# Altium schematic sheet MicroMultimeter__PROBE_Sch.SchDoc: MicroMultimeter - Probe
size 152 x 101 mm; Author: Hom; CompanyName: KitSprout; DrawnBy: Hom; Engineer: Hom; Organization: KitSprout; Revision: A; SheetNumber: 1; SheetTotal: 1; License: CC BY-SA 4.0; Version: 1.0; LibVersion: 1.4; PageSetup: Record=PageOptions|CenterHorizontal=True|CenterVertical=True|PrintScale=1.00|XCorrection=1.00|YCorrection=1.00|PrintKind=0|BorderSize=5000000|LeftOffset=0|BottomOffset=0|Orientation=2|PaperLength=1000|PaperWidth=1000|Scale=100|PaperSource=7|PrintQuality=-3|MediaType=1|DitherType=10|PrintScaleMode=0|PaperKind=A4|PaperIndex=9
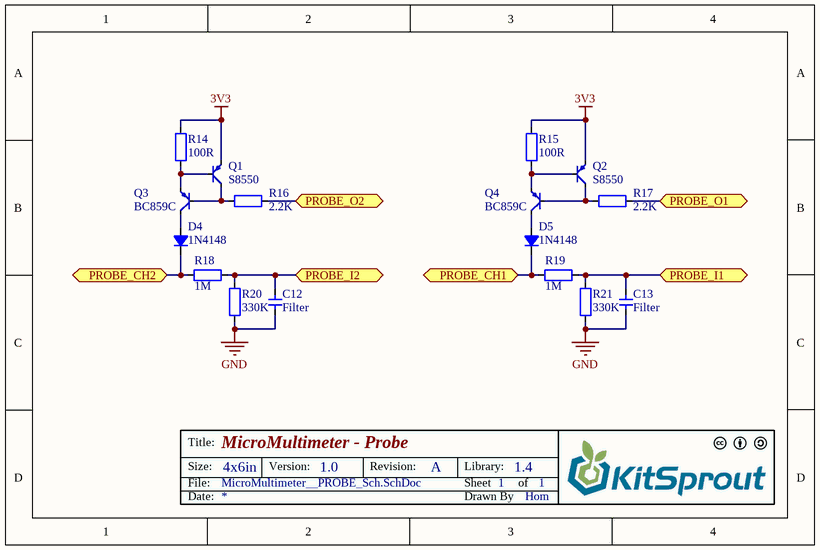
[diagram p0: MicroMultimeter__PROBE_Sch.SchDoc]

## Parts
C12  value Filter  [CAP_0603]  (hidden comment: Cap_0603)
C13  value Filter  [CAP_0603]  (hidden comment: Cap_0603)
D4  value 1N4148  [SOD323]  (hidden comment: Diode_SOD323)
D5  value 1N4148  [SOD323]  (hidden comment: Diode_SOD323)
Q1  value S8550  [SOT23-3]  (hidden comment: BJT_PNP)
Q2  value S8550  [SOT23-3]  (hidden comment: BJT_PNP)
Q3  value BC859C  [SOT23-3]  (hidden comment: BJT_PNP)
Q4  value BC859C  [SOT23-3]  (hidden comment: BJT_PNP)
R14  value 100R  [RES_0603]  (hidden comment: Res_0603)
R15  value 100R  [RES_0603]  (hidden comment: Res_0603)
R16  value 2.2K  [RES_0603]  (hidden comment: Res_0603)
R17  value 2.2K  [RES_0603]  (hidden comment: Res_0603)
R18  value 1M  [RES_0603]  (hidden comment: Res_0603)
R19  value 1M  [RES_0603]  (hidden comment: Res_0603)
R20  value 330K  [RES_0603]  (hidden comment: Res_0603)
R21  value 330K  [RES_0603]  (hidden comment: Res_0603)

## Ports
PROBE_CH1, PROBE_CH2 (bidir), PROBE_I1, PROBE_I2, PROBE_O1, PROBE_O2

## Nets
3V3: Q1.2(E) Q2.2(E) R14.2 R15.2
GND: C12.1 C13.1 R20.1 R21.1
PROBE_CH1: D5.2(K) R19.2 ; port PROBE_CH1
PROBE_CH2: D4.2(K) R18.2 ; port PROBE_CH2
PROBE_I1: C13.2 R19.1 R21.2 ; port PROBE_I1
PROBE_I2: C12.2 R18.1 R20.2 ; port PROBE_I2
PROBE_O1: R17.1 ; port PROBE_O1
PROBE_O2: R16.1 ; port PROBE_O2
NetD4_1: D4.1(A) Q3.3(C)
NetD5_1: D5.1(A) Q4.3(C)
NetQ1_1: Q1.1(B) Q3.2(E) R14.1
NetQ1_3: Q1.3(C) Q3.1(B) R16.2
NetQ2_1: Q2.1(B) Q4.2(E) R15.1
NetQ2_3: Q2.3(C) Q4.1(B) R17.2

## Notes on the sheet
- Title:
- Size:
- Date:
- File:
- 4x6in
- Version:
- Revision:
- Sheet
- Drawn By
- Library:
- of

## Library data of the parts
C12 C13 = Cap_0603: Capacitor
D4 D5 = Diode_SOD323: Diode
Q1-Q4 = BJT_PNP: Transistor
R14-R21 = Res_0603: Resistor